# Altium schematic sheet [2]_Power_Budget.SchDoc
size A; DocumentNumber: 2; SheetNumber: 2; SheetTotal: 11
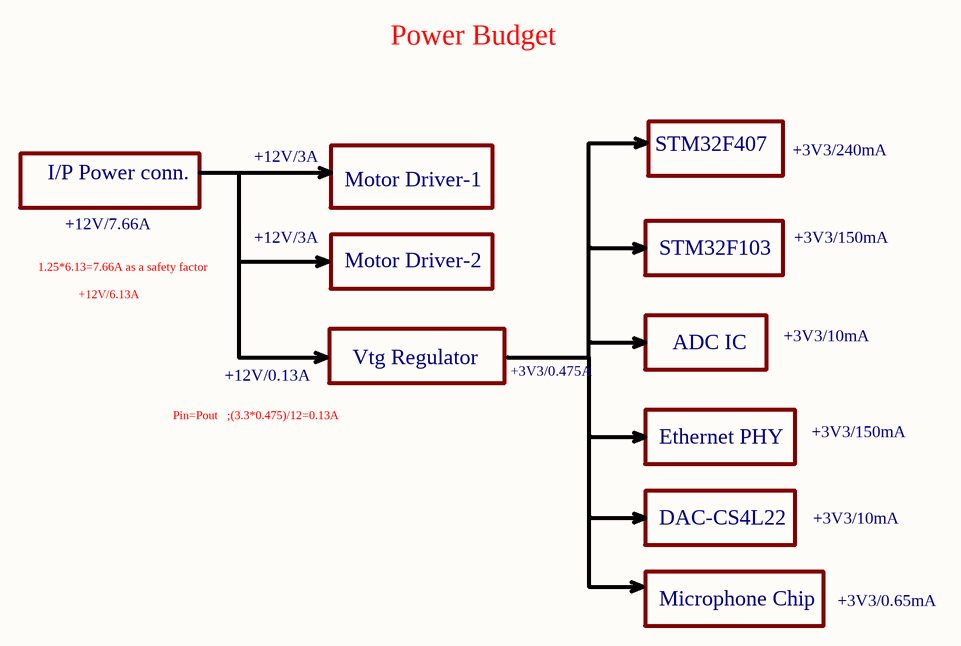
[diagram p0: [2]_Power_Budget.SchDoc]

## Notes on the sheet
- Power Budget
- I/P Power conn.
- +12V/3A
- STM32F407
- +3V3/240mA
- +12V/7.66A
- Motor Driver-1
- +3V3/150mA
- 1.25*6.13=7.66A as a safety factor
- +12V/6.13A
- Motor Driver-2
- STM32F103
- +12V/0.13A
- Vtg Regulator
- +3V3/0.475A
- ADC IC
- +3V3/10mA
- Pin=Pout   ;(3.3*0.475)/12=0.13A
- Ethernet PHY
- DAC-CS4L22
- Microphone Chip
- +3V3/0.65mA